# Altium project OpenRex_V1I1.PrjPcb (part 4 of 4)

## Sheet [14] - MCU.SchDoc
size A2; DocumentNumber: 14; SheetNumber: 14; SheetTotal: 31
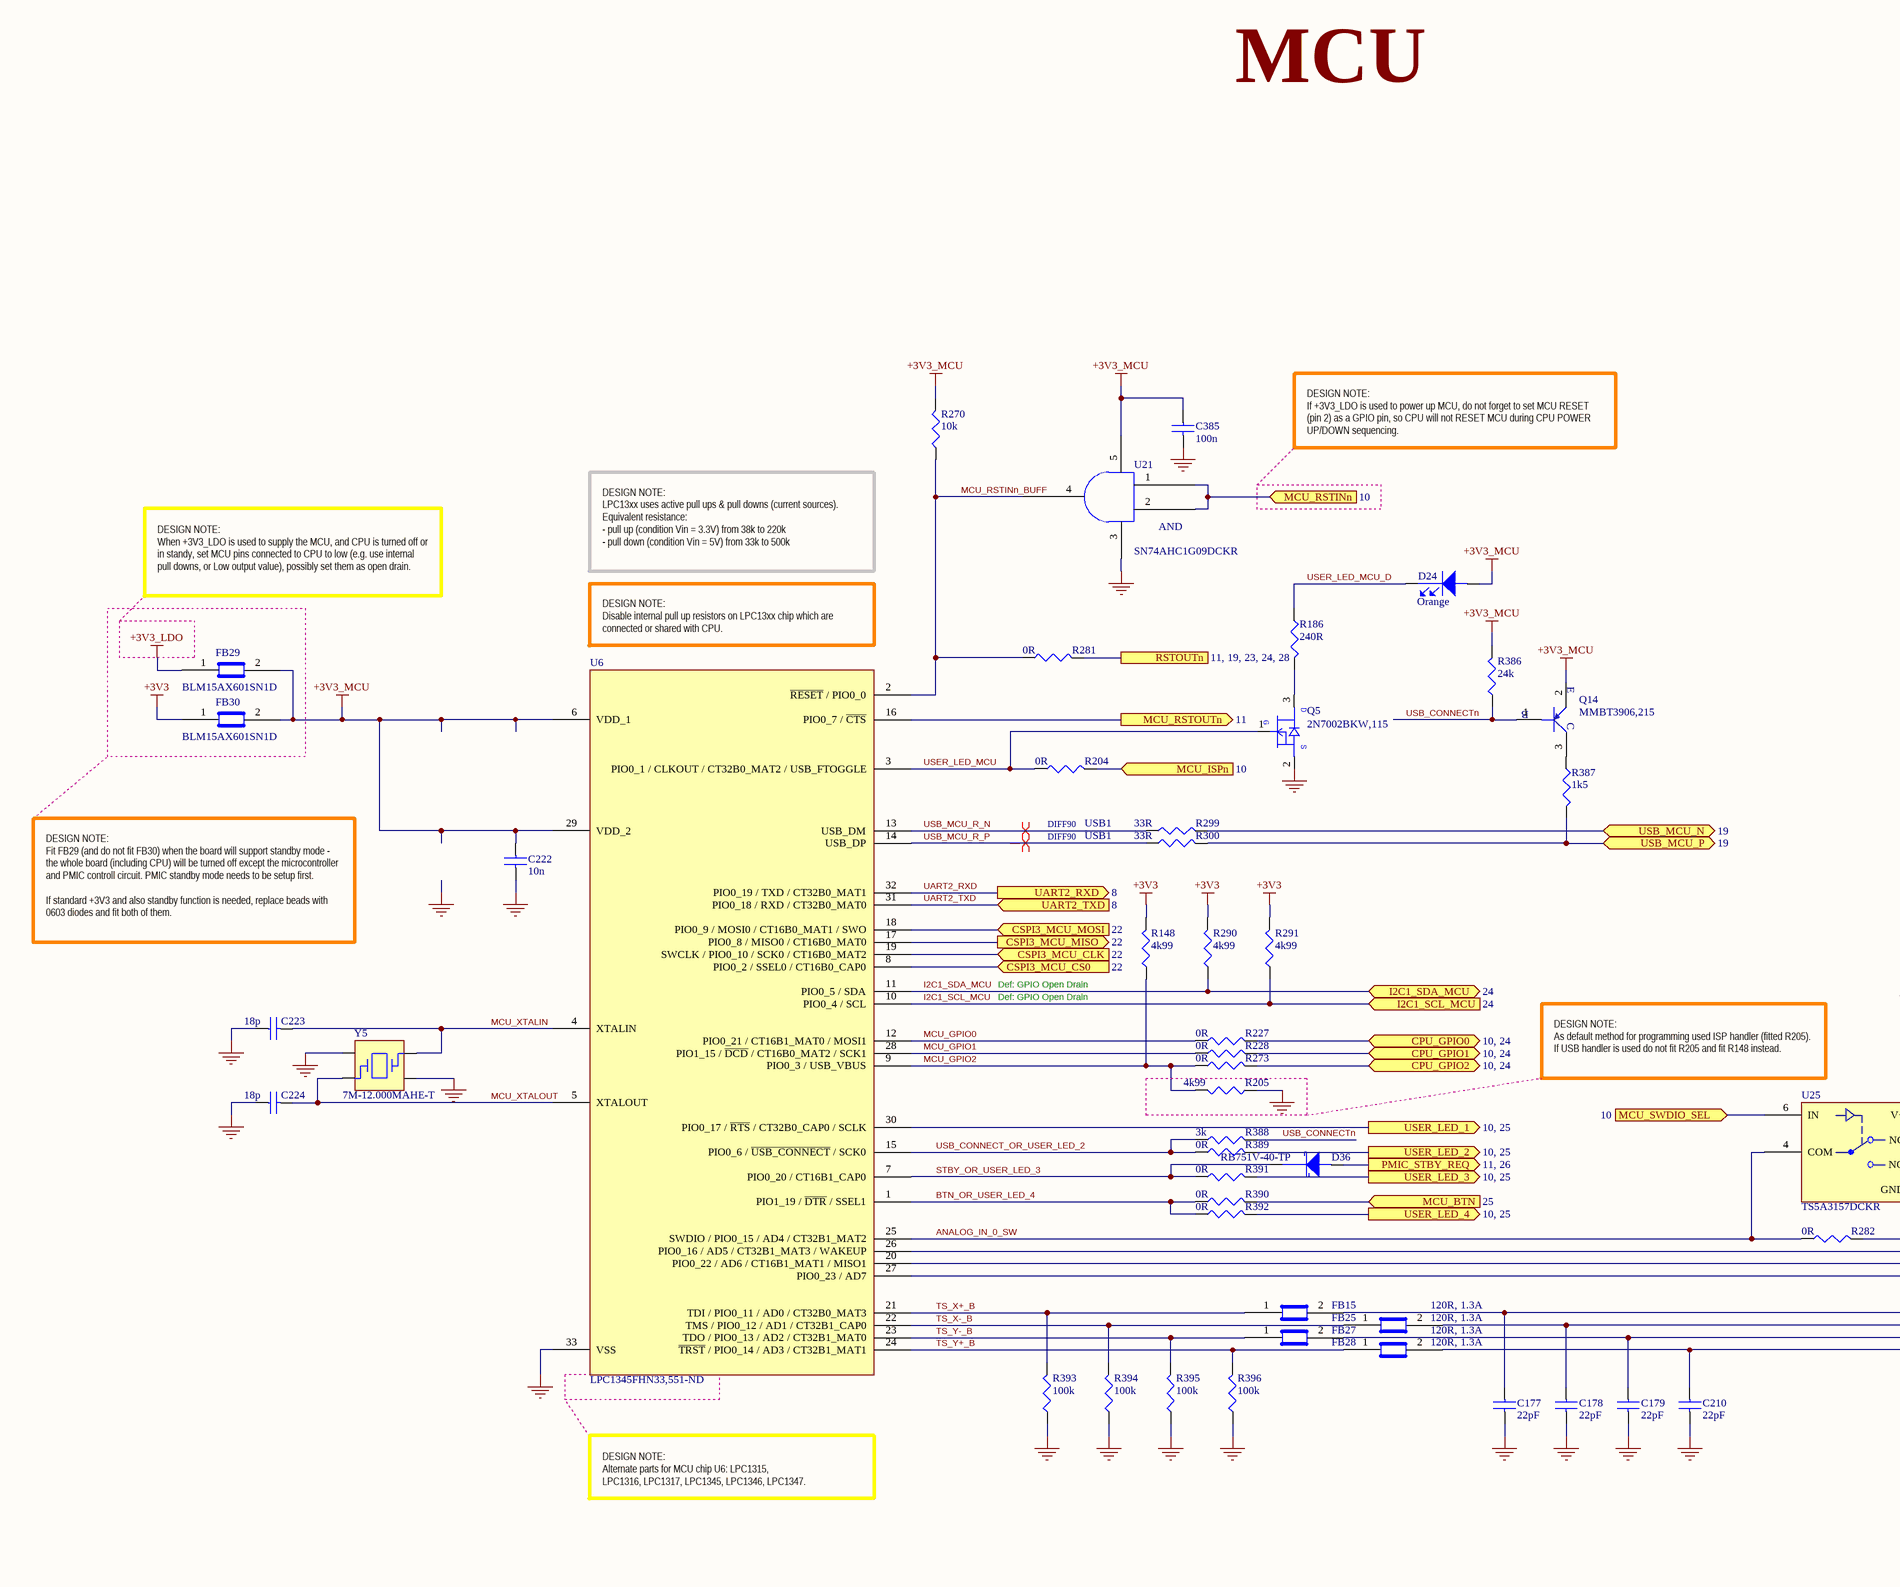
[diagram p16: [14] - MCU.SchDoc, left]
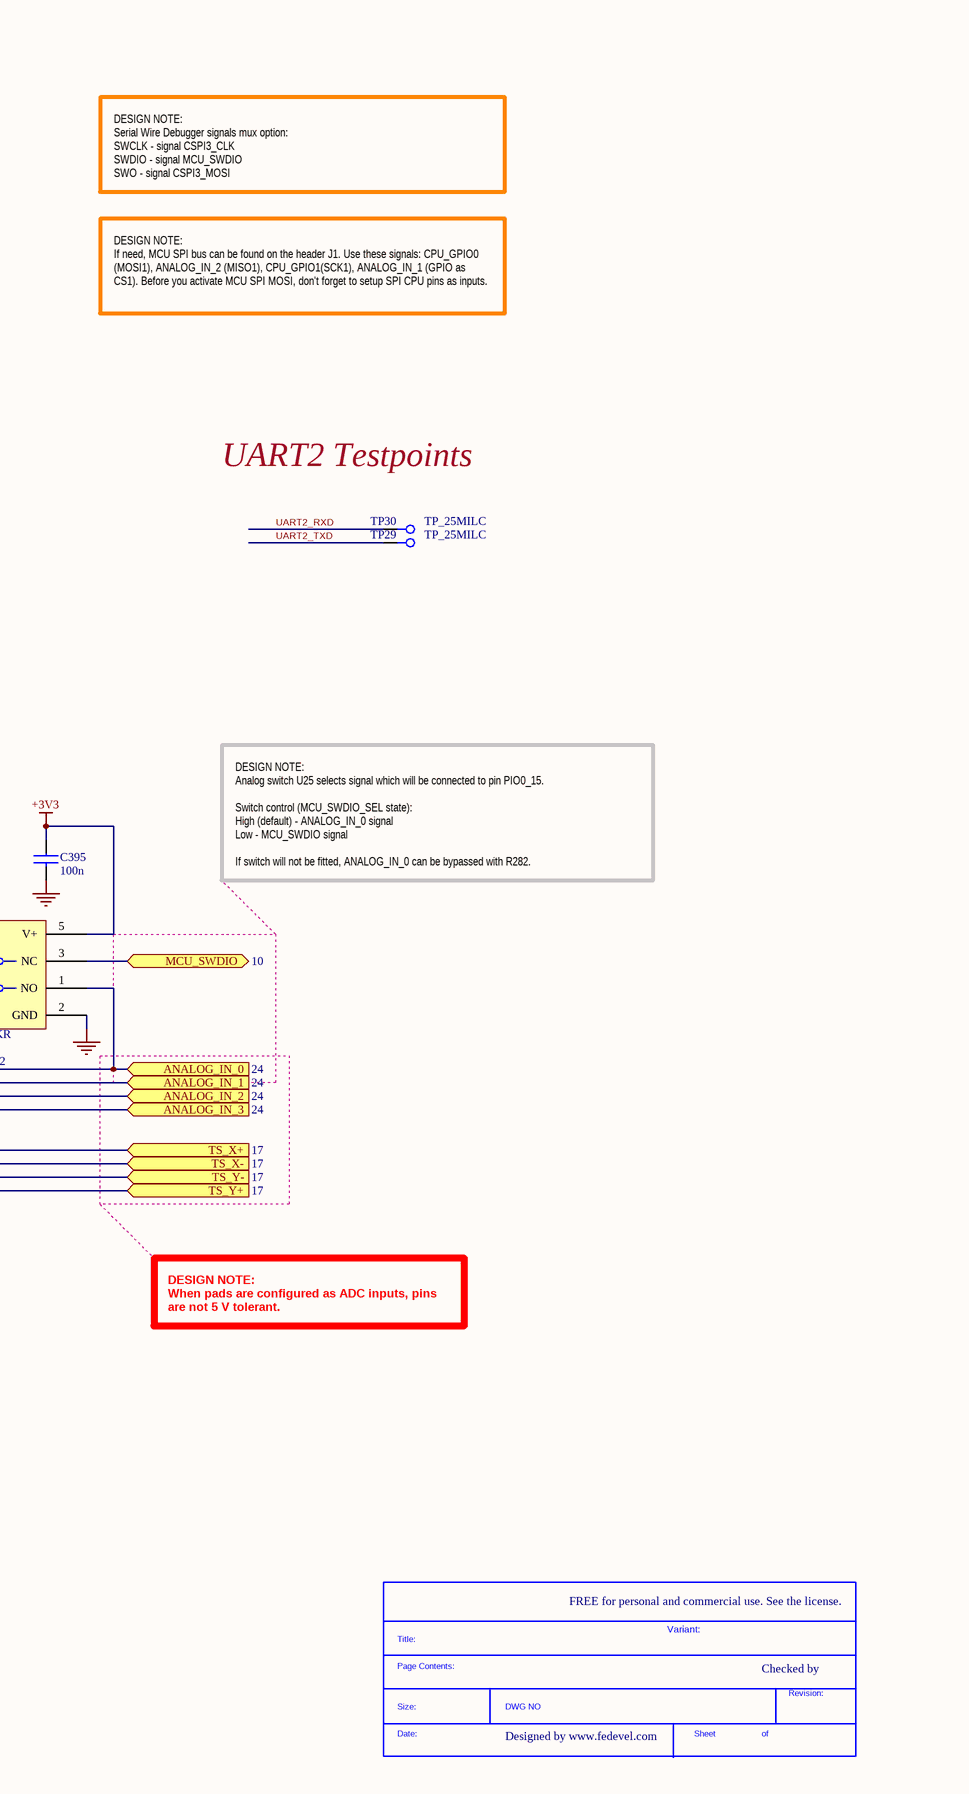
[diagram p17: [14] - MCU.SchDoc, right]

### Parts
(Parts that share a designator on the sheet are numbered #1, #2 ... from top to bottom, then left to right.)
*#11  SDTitleBlock  (value not drawn)  (graphical)
C177  22pF  [C0402]
C178  22pF  [C0402]
C179  22pF  [C0402]
C210  22pF  [C0402]
C222  10n  [C0402]
C223  18p  [C0402]
C224  18p  [C0402]
C385  100n  [C0402]
C395  100n  [C0402]
D24  Orange  [LED_0603]
D36  RB751V-40-TP  [SOD323]
FB15  120R, 1.3A  [C0402]
FB25  120R, 1.3A  [C0402]
FB27  120R, 1.3A  [C0402]
FB28  120R, 1.3A  [C0402]
FB29  BLM15AX601SN1D  [C0402]
FB30  BLM15AX601SN1D  [C0402]
Q5  2N7002BKW,115  [SC70_SOT323]
Q14  MMBT3906,215  [SOT-23-3-123]
R148  4k99  [R0402]
R186  240R  [R0402]
R204  0R  [R0402]
R205  4k99  [R0402]
R227  0R  [R0402]
R228  0R  [R0402]
R270  10k  [R0402]
R273  0R  [R0402]
R281  0R  [R0402]
R282  0R  [R0402]
R290  4k99  [R0402]
R291  4k99  [R0402]
R299  33R  [R0402]
R300  33R  [R0402]
R386  24k  [R0402]
R387  1k5  [R0402]
R388  3k  [R0402]
R389  0R  [R0402]
R390  0R  [R0402]
R391  0R  [R0402]
R392  0R  [R0402]
R393  100k  [R0402]
R394  100k  [R0402]
R395  100k  [R0402]
R396  100k  [R0402]
TP29  TP_25MILC  [TP_25C]  (no BOM)
TP30  TP_25MILC  [TP_25C]  (no BOM)
U6  LPC1345FHN33,551-ND  [HVQFN33_7x7mm]
U21  SN74AHC1G09DCKR  [SC70_5]
U25  TS5A3157DCKR  [SC70_6]
Y5  7M-12.000MAHE-T  [7M]

### Ports
ANALOG_IN_0 (in, see 24), ANALOG_IN_1 (in, see 24), ANALOG_IN_2 (in, see 24), ANALOG_IN_3 (in, see 24), CPU_GPIO0 (bidir, see 10, 24), CPU_GPIO1 (bidir, see 10, 24), CPU_GPIO2 (bidir, see 10, 24), CSPI3_MCU_CLK (in, see 22), CSPI3_MCU_CS0 (in, see 22), CSPI3_MCU_MISO (out, see 22), CSPI3_MCU_MOSI (in, see 22), I2C1_SCL_MCU (in, see 24), I2C1_SDA_MCU (bidir, see 24), MCU_BTN (in, see 25), MCU_ISPn (in, see 10), MCU_RSTINn (in, see 10), MCU_RSTOUTn (out, see 11), MCU_SWDIO (bidir, see 10), MCU_SWDIO_SEL (in, see 10), PMIC_STBY_REQ (out, see 11, 26), RSTOUTn (see 11, 19, 23, 24, 28), TS_X+ (in, see 17), TS_X- (in, see 17), TS_Y+ (in, see 17), TS_Y- (in, see 17), UART2_RXD (out, see 8), UART2_TXD (in, see 8), USB_MCU_N (bidir, see 19), USB_MCU_P (bidir, see 19), USER_LED_1 (out, see 10, 25), USER_LED_2 (out, see 10, 25), USER_LED_3 (out, see 10, 25), USER_LED_4 (out, see 10, 25)

### Nets
+3V3: C395.1 FB30.1 R148.2 R290.2 R291.2 U25.5(V+)
+3V3_LDO: FB29.1
+3V3_MCU: C222.1 C385.1 D24.2(ANODE) FB29.2 FB30.2 Q14.2(E) R270.2 R386.2 U6.6(VDD_1) U6.29(VDD_2) U21.5(VCC)
GND: C177.2 C178.2 C179.2 C210.2 C222.2 C223.1 C224.1 C385.2 C395.2 Q5.2(SOURCE) R205.1 R393.1 R394.1 R395.1 R396.1 U6.33(VSS) U21.3(GND) U25.2(GND) Y5.2 Y5.4
ANALOG_IN_0: R282.2 U25.1(NO) ; port ANALOG_IN_0
ANALOG_IN_0_SW: R282.1 U6.25(SWDIO_/_PIO0_15_/_AD4_/_CT32B1_MAT2) U25.4(COM)
ANALOG_IN_1: U6.26(PIO0_16_/_AD5_/_CT32B1_MAT3_/_WAKEUP) ; port ANALOG_IN_1
ANALOG_IN_2: U6.20(PIO0_22_/_AD6_/_CT16B1_MAT1_/_MISO1) ; port ANALOG_IN_2
ANALOG_IN_3: U6.27(PIO0_23_/_AD7) ; port ANALOG_IN_3
BTN_OR_USER_LED_4: R390.1 R392.1 U6.1(PIO1_19_/_~{DTR}_/_SSEL1)
CPU_GPIO0: R227.2 ; port CPU_GPIO0
CPU_GPIO1: R228.2 ; port CPU_GPIO1
CPU_GPIO2: R273.2 ; port CPU_GPIO2
CSPI3_MCU_CLK: U6.19(SWCLK_/_PIO0_10_/_SCK0_/_CT16B0_MAT2) ; port CSPI3_MCU_CLK
CSPI3_MCU_CS0: U6.8(PIO0_2_/_SSEL0_/_CT16B0_CAP0) ; port CSPI3_MCU_CS0
CSPI3_MCU_MISO: U6.17(PIO0_8_/_MISO0_/_CT16B0_MAT0) ; port CSPI3_MCU_MISO
CSPI3_MCU_MOSI: U6.18(PIO0_9_/_MOSI0_/_CT16B0_MAT1_/_SWO) ; port CSPI3_MCU_MOSI
I2C1_SCL_MCU: R291.1 U6.10(PIO0_4_/_SCL) ; port I2C1_SCL_MCU
I2C1_SDA_MCU: R290.1 U6.11(PIO0_5_/_SDA) ; port I2C1_SDA_MCU
MCU_BTN: R390.2 ; port MCU_BTN
MCU_GPIO0: R227.1 U6.12(PIO0_21_/_CT16B1_MAT0_/_MOSI1)
MCU_GPIO1: R228.1 U6.28(PIO1_15_/_~{DCD}_/_CT16B0_MAT2_/_SCK1)
MCU_GPIO2: R148.1 R205.2 R273.1 U6.9(PIO0_3_/_USB_VBUS)
MCU_ISPn: R204.2 ; port MCU_ISPn
MCU_RSTINn: U21.1(A) U21.2(B) ; port MCU_RSTINn
MCU_RSTINn_BUFF: R270.1 R281.1 U6.2(~{RESET}_/_PIO0_0) U21.4(Y)
MCU_RSTOUTn: U6.16(PIO0_7_/_~{CTS}) ; port MCU_RSTOUTn
MCU_SWDIO: U25.3(NC) ; port MCU_SWDIO
MCU_SWDIO_SEL: U25.6(IN) ; port MCU_SWDIO_SEL
MCU_XTALIN: C223.2 U6.4(XTALIN) Y5.1
MCU_XTALOUT: C224.2 U6.5(XTALOUT) Y5.3
PMIC_STBY_REQ: D36.2(ANODE) ; port PMIC_STBY_REQ
RSTOUTn: R281.2 ; port RSTOUTn
STBY_OR_USER_LED_3: D36.1(cathode) R391.1 U6.7(PIO0_20_/_CT16B1_CAP0)
TS_X+: C177.1 FB15.2 ; port TS_X+
TS_X+_B: FB15.1 R393.2 U6.21(TDI_/_PIO0_11_/_AD0_/_CT32B0_MAT3)
TS_X-: C178.1 FB25.2 ; port TS_X-
TS_X-_B: FB25.1 R394.2 U6.22(TMS_/_PIO0_12_/_AD1_/_CT32B1_CAP0)
TS_Y+: C210.1 FB28.2 ; port TS_Y+
TS_Y+_B: FB28.1 R396.2 U6.24(~{TRST}_/_PIO0_14_/_AD3_/_CT32B1_MAT1)
TS_Y-: C179.1 FB27.2 ; port TS_Y-
TS_Y-_B: FB27.1 R395.2 U6.23(TDO_/_PIO0_13_/_AD2_/_CT32B1_MAT0)
UART2_RXD: TP30.1 U6.32(PIO0_19_/_TXD_/_CT32B0_MAT1) ; port UART2_RXD
UART2_TXD: TP29.1 U6.31(PIO0_18_/_RXD_/_CT32B0_MAT0) ; port UART2_TXD
USB_CONNECT_OR_USER_LED_2: R388.1 R389.1 U6.15(PIO0_6_/_~{USB_CONNECT}_/_SCK0)
USB_CONNECTn: Q14.1(B) R386.1 R388.2
USB_MCU_N: R299.2 ; port USB_MCU_N
USB_MCU_P: R300.2 R387.2 ; port USB_MCU_P
USB_MCU_R_N: R299.1 U6.13(USB_DM)
USB_MCU_R_P: R300.1 U6.14(USB_DP)
USER_LED_1: U6.30(PIO0_17_/_~{RTS}_/_CT32B0_CAP0_/_SCLK) ; port USER_LED_1
USER_LED_2: R389.2 ; port USER_LED_2
USER_LED_3: R391.2 ; port USER_LED_3
USER_LED_4: R392.2 ; port USER_LED_4
USER_LED_MCU: Q5.1(GATE) R204.1 U6.3(PIO0_1_/_CLKOUT_/_CT32B0_MAT2_/_USB_FTOGGLE)
USER_LED_MCU_D: D24.1(cathode) R186.1
NetQ5_3: Q5.3(DRAIN) R186.2
NetQ14_3: Q14.3(C) R387.1

### Layout directives
differential pair; net class DIFF90; net class USB1: USB_MCU_R_N, USB_MCU_R_P

### Notes on the sheet
- MCU
- DESIGN NOTE:
  If +3V3_LDO is used to power up MCU, do not forget to set MCU RESET (pin 2) as a GPIO pin, so CPU will not RESET MCU during CPU POWER UP/DOWN sequencing.
- DESIGN NOTE:
  Serial Wire Debugger signals mux option:
  SWCLK - signal CSPI3_CLK
  SWDIO - signal MCU_SWDIO
  SWO - signal CSPI3_MOSI
- DESIGN NOTE:
  LPC13xx uses active pull ups & pull downs (current sources).
  Equivalent resistance:
  - pull up (condition Vin = 3.3V) from 38k to 220k
  - pull down (condition Vin = 5V) from 33k to 500k
- DESIGN NOTE:
  If need, MCU SPI bus can be found on the header J1. Use these signals: CPU_GPIO0 (MOSI1), ANALOG_IN_2 (MISO1), CPU_GPIO1(SCK1), ANALOG_IN_1 (GPIO as CS1). Before you activate MCU SPI MOSI, don't forget to setup SPI CPU pins as inputs.
- DESIGN NOTE:
  When +3V3_LDO is used to supply the MCU, and CPU is turned off or in standy, set MCU pins connected to CPU to low (e.g. use internal pull downs, or Low output value), possibly set them as open drain.
- DESIGN NOTE:
  Disable internal pull up resistors on LPC13xx chip which are connected or shared with CPU.
- UART2 Testpoints
- DESIGN NOTE:
  Fit FB29 (and do not fit FB30) when the board will support standby mode - the whole board (including CPU) will be turned off except the microcontroller and PMIC controll circuit. PMIC standby mode needs to be setup first.
  If standard +3V3 and also standby function is needed, replace beads with 0603 diodes and fit both of them.
- Def: GPIO Open Drain
- DESIGN NOTE:
  Analog switch U25 selects signal which will be connected to pin PIO0_15.
  Switch control (MCU_SWDIO_SEL state):
  High (default) - ANALOG_IN_0 signal
  Low - MCU_SWDIO signal
  If switch will not be fitted, ANALOG_IN_0 can be bypassed with R282.
- (near U25) DESIGN NOTE:
  As default method for programming used ISP handler (fitted R205). If USB handler is used do not fit R205 and fit R148 instead.
- DESIGN NOTE:
  Alternate parts for MCU chip U6: LPC1315,
  LPC1316, LPC1317, LPC1345, LPC1346, LPC1347.
- DESIGN NOTE:
  When pads are configured as ADC inputs, pins are not 5 V tolerant.
- FREE for personal and commercial use. See the license.
- Variant:
- Checked by
- Designed by www.fedevel.com
- (in symbol 2N7002BKW,115) D; G; S
- (in symbol SDTitleBlock) Title:; Page Contents:; Revision:; Size:; DWG NO; Date:; Sheet; of
- (in symbol SN74AHC1G09DCKR) AND

### Library data of the parts
C177-C179 C210 = C1005C0G1H220J: CAP CER 22PF 50V C0G 5% 0402; Manufacturer: TDK Corporation; .Checked PCB: used; Temperature Coefficient: C0G, NP0; Capacitance: 22pF; Category: Capacitors; Supplier Part Number: 445-1239-1-ND; Manufacturer Part Number: C1005C0G1H220J; Operating Temperature: -55°C ~ 125°C; Package / Case: 0402 (1005 Metric); Price 1k [$]: 0.00442; Value: 22pF; .Checked SCH: used; Voltage - Rated: 50V; Supplier: Digikey; Supplier 1: Digi-Key; Supplier Part Number 1: 445-1239-1-ND; RoHS: RoHS Compliant; Stock 1: 176261; Pricing 1: 1=0.08, 10=0.05, 100=0.018, 250=0.013, 500=0.0096, 1000=0.0065 (USD); Tolerance: ±5%; Mounting Type: Surface Mount, MLCC; Applications: General Purpose; Ratings: -; Size / Dimension: 0.039" L x 0.020" W (1.00mm x 0.50mm); Height - Seated (Max): -; Thickness (Max): 0.022" (0.55mm); Lead Spacing: -; Features: -; Packaging: Cut Tape (CT); Lead Style: -; ComponentLink1URL: http://www.tdk.co.jp/tefe02/e412_c.pdf; ComponentLink1Description: http://www.tdk.co.jp/tefe02/e412_c.pdf
C222 = C1005X7R1H103K: CAP CER 10000PF 50V 10% X7R 0402; Manufacturer: TDK Corporation; Value: 10nF; .Checked PCB: used; Capacitance: 10000pF; Category: Capacitors; Supplier Part Number: 445-6850-1-ND; Manufacturer Part Number: C1005X7R1H103K; Operating Temperature: -55°C ~ 125°C; Package / Case: 0402 (1005 Metric); Price 1k [$]: 0.01625; .Checked SCH: used; Voltage - Rated: 50V; Supplier: Digikey; Supplier 1: Digi-Key; Supplier Part Number 1: 445-6850-1-ND; RoHS: RoHS Compliant; Stock 1: 3901; Pricing 1: 1=0.2, 10=0.125, 100=0.045, 250=0.03252, 500=0.024, 1000=0.01625 (USD); Tolerance: ±10%; Temperature Coefficient: X7R; Mounting Type: Surface Mount, MLCC; Applications: General Purpose; Ratings: -; Size / Dimension: 0.039" L x 0.020" W (1.00mm x 0.50mm); Height - Seated (Max): -; Thickness (Max): 0.022" (0.55mm); Lead Spacing: -; Features: -; Packaging: Cut Tape (CT); Lead Style: -; ComponentLink1URL: http://www.tdk.co.jp/tefe02/e412_c.pdf; ComponentLink1Description: http://www.tdk.co.jp/tefe02/e412_c.pdf
C223 C224 = C1005C0G1H180J: CAP CER 18PF 50V C0G 5% 0402; Manufacturer: TDK Corporation; .Checked PCB: used; Temperature Coefficient: C0G, NP0; Capacitance: 18pF; Category: Capacitors; Supplier Part Number: 445-1238-1-ND; Manufacturer Part Number: C1005C0G1H180J; Operating Temperature: -55°C ~ 125°C; Package / Case: 0402 (1005 Metric); Price 1k [$]: 0.00468; Value: 18pF; .Checked SCH: used; Voltage - Rated: 50V; Supplier: Digikey; Supplier 1: Digi-Key; Supplier Part Number 1: 445-1238-1-ND; RoHS: RoHS Compliant; Stock 1: 24321; Pricing 1: 1=0.08, 10=0.05, 100=0.018, 250=0.013, 500=0.0096, 1000=0.0065 (USD); Tolerance: ±5%; Mounting Type: Surface Mount, MLCC; Applications: General Purpose; Ratings: -; Size / Dimension: 0.039" L x 0.020" W (1.00mm x 0.50mm); Height - Seated (Max): -; Thickness (Max): 0.022" (0.55mm); Lead Spacing: -; Features: -; Packaging: Cut Tape (CT); Lead Style: -; ComponentLink1URL: http://www.tdk.co.jp/tefe02/e412_c.pdf; ComponentLink1Description: http://www.tdk.co.jp/tefe02/e412_c.pdf
C385 C395 = C1005X5R1H104K: CAP CER .10UF 50V X5R 10% 0402; Manufacturer: TDK Corporation; Capacitance: 0.1µF; Value: 100nF; .Checked PCB: used; Category: Capacitors; Manufacturer Part Number: C1005X5R1H104K; Operating Temperature: -55°C ~ 85°C; Package / Case: 0402 (1005 Metric); Price 1k [$]: 0.02340; .Checked SCH: used; Voltage - Rated: 50V; Supplier Part Number: 445-5942-1-ND; Supplier: Digikey; Supplier 1: Digi-Key; Supplier Part Number 1: 445-5942-1-ND; RoHS: RoHS Compliant; Stock 1: 106926; Pricing 1: 1=0.27, 10=0.18, 100=0.072, 250=0.05176, 500=0.0369, 1000=0.027 (USD); Tolerance: ±10%; Temperature Coefficient: X5R; Mounting Type: Surface Mount, MLCC; Applications: General Purpose; Ratings: -; Size / Dimension: 0.039" L x 0.020" W (1.00mm x 0.50mm); Height - Seated (Max): -; Thickness (Max): 0.022" (0.55mm); Lead Spacing: -; Features: -; Packaging: Cut Tape (CT); Lead Style: -; ComponentLink1URL: http://www.tdk.co.jp/tefe02/e412_c.pdf; ComponentLink1Description: http://www.tdk.co.jp/tefe02/e412_c.pdf
D24 = LO L29K-H2K1-24-Z: LED SMARTLED ORANGE 606NM 0603; Manufacturer: OSRAM Opto Semiconductors Inc; Millicandela Rating: 6.3mcd; Voltage - Forward (Vf) Typ: 1.8V; Current - Test: 2mA; Wavelength - Peak: 610nm; Viewing Angle: 160°; Lens Type: Diffused; Lens Style/Size: Rectangle with Flat Top, 1.3mm x 0.8mm; Luminous Flux @ Current - Test: 25 mlm; .Checked PCB: used; Supplier 1: Digi-Key; Supplier Part Number 1: 475-2740-1-ND; Manufacturer Part Number: LO L29K-H2K1-24-Z; RoHS: RoHS Compliant; Category: Optoelectronics; Stock 1: 15900; Pricing 1: 1=0.17, 10=0.141, 100=0.1127, 250=0.0986, 500=0.09016 (USD); Color: Orange; Wavelength - Dominant: 606nm; Package / Case: 0603 (1608 Metric); Size / Dimension: 1.70mm L x 0.80mm W; Height: 0.65mm; Mounting Type: Surface Mount; Packaging: Cut Tape (CT); ComponentLink1URL: http://catalog.osram-os.com/catalogue/catalogue.do;jsessionid=302CF83AF637AE24E40AEB0ADA267EDD?act=downloadFile&favOid=020000010003f9de000100b6; ComponentLink1Description: http://catalog.osram-os.com/catalogue/catalogue.do;jsessionid=302CF83AF637AE24E40AEB0ADA267EDD?act=downloadFile&favOid=020000010003f9de000100b6; .Checked SCH: used
D36 = RB751V-40-TP: DIODE SCHTKY 30MA 30V SOD-323; Manufacturer: Micro Commercial Co; Diode Type: Schottky; Voltage - Forward (Vf) (Max) @ If: 370mV @ 1mA; Speed: Small Signal =< 200mA (Io), Any Speed; Current - Reverse Leakage @ Vr: 500nA @ 30V; Capacitance @ Vr, F: 2pF @ 1V, 1MHz; .Checked PCB: used; Supplier 1: Digi-Key; Supplier Part Number 1: RB751V-40-TPMSCT-ND; Manufacturer Part Number: RB751V-40-TP; RoHS: RoHS Compliant; Category: Discrete Semiconductor Products; Stock 1: 18964; Pricing 1: 1=0.48, 10=0.342, 100=0.2014, 250=0.14252, 500=0.1216, 1000=0.095 (USD); Voltage - DC Reverse (Vr) (Max): 30V; Current - Average Rectified (Io): 30mA; Reverse Recovery Time (trr): -; Mounting Type: Surface Mount; Package / Case: SC-76, SOD-323; Supplier Device Package: SOD-323; Packaging: Cut Tape (CT); ComponentLink1URL: http://61.222.192.61/mccsemi/up_pdf/RB751V-40(SOD-323).PDF; ComponentLink1Description: http://61.222.192.61/mccsemi/up_pdf/RB751V-40(SOD-323).PDF; .Checked SCH: used
FB15 FB25 FB27 FB28 = BLM15PD121SN1D: FERRITE CHIP 120 OHM 1300MA 0402; Manufacturer: Murata Electronics North America; Impedance @ Frequency: 120 Ohm @ 100MHz; DC Resistance (DCR): 90 mOhm Max; Filter Type: Differential Mode - Single; .Checked PCB: MM; Supplier 1: Digi-Key; Manufacturer Part Number: BLM15PD121SN1D; RoHS: RoHS Compliant; Category: Filters; Stock 1: 478960; Pricing 1: 1=0.12, 10=0.096, 50=0.0636, 100=0.0549, 250=0.04332, 500=0.03658, 1000=0.0308, 5000=0.02743 (USD); Packaging: Cut Tape (CT); Current Rating: 1.3A; Package / Case: 0402 (1005 Metric); Mounting Type: Surface Mount; Height (Max): 0.022" (0.55mm); Size / Dimension: 0.039" L x 0.020" W (1.00mm x 0.50mm); ComponentLink1URL: http://media.digikey.com/pdf/Data%20Sheets/Murata%20PDFs/BLM15P_Series.pdf; ComponentLink1Description: http://media.digikey.com/pdf/Data%20Sheets/Murata%20PDFs/BLM15P_Series.pdf; Supplier Part Number 1: 490-5203-1-ND; .Checked SCH: MM; .Creator: MM
FB29 FB30 = BLM15AX601SN1D: FERRITE CHIP 600 OHM 0402 420mA; Manufacturer: Murata Electronics North America; .Checked PCB: used; Impedance @ Frequency: 600 Ohm @ 100MHz; DC Resistance (DCR): 340 mOhm Max; Filter Type: Differential Mode - Single; Number of Lines: 1; .Checked SCH: used; Category: Filters; Manufacturer Part Number: BLM15AX601SN1D; Package / Case: 0402 (1005 Metric); Current Rating: 420mA; Supplier 1: Digi-Key; Supplier Part Number 1: 490-5441-1-ND; RoHS: RoHS Compliant; Stock 1: 34008; Pricing 1: 1=0.26, 10=0.197, 50=0.1148, 100=0.0918, 250=0.0656, 500=0.0446, 1000=0.03608, 5000=0.02821 (USD); Mounting Type: Surface Mount; Packaging: Cut Tape (CT); Height (Max): 0.022" (0.55mm); Size / Dimension: 0.039" L x 0.020" W (1.00mm x 0.50mm); ComponentLink1URL: http://search.murata.co.jp/Ceramy/image/img/PDF/ENG/L0110S0100BLM15AX_SN.pdf; ComponentLink1Description: http://search.murata.co.jp/Ceramy/image/img/PDF/ENG/L0110S0100BLM15AX_SN.pdf; Supplier Part Number: 490-5441-1-ND; Price 1k [$]: 0.03280; Value: BLM15AX601SN1D; Supplier: Digikey
Q5 = 2N7002BKW,115: MOSFET N-CH 60V 310MA SOT323; Manufacturer: NXP Semiconductors; FET Type: MOSFET N-Channel, Metal Oxide; FET Feature: Logic Level Gate; Rds On (Max) @ Id, Vgs: 1.6 Ohm @ 500mA, 10V; Vgs(th) (Max) @ Id: 2.1V @ 250µA; Gate Charge (Qg) @ Vgs: 0.6nC @ 4.5V; Input Capacitance (Ciss) @ Vds: 50pF @ 10V; Power - Max: 275mW; .Checked PCB: used; Supplier 1: Digi-Key; Supplier Part Number 1: 568-5980-1-ND; Manufacturer Part Number: 2N7002BKW,115; RoHS: RoHS Compliant; Category: Discrete Semiconductor Products; Stock 1: 15666; Pricing 1: 1=0.39, 10=0.354, 25=0.2548, 100=0.1983, 250=0.12456, 500=0.10616, 1000=0.07233 (USD); Drain to Source Voltage (Vdss): 60V; Current - Continuous Drain (Id) @ 25° C: 310mA; Mounting Type: Surface Mount; Package / Case: SC-70, SOT-323; Supplier Device Package: SC-70; Packaging: Cut Tape (CT); ComponentLink1URL: http://www.nxp.com/documents/data_sheet/2N7002BKW.pdf; ComponentLink1Description: http://www.nxp.com/documents/data_sheet/2N7002BKW.pdf; .Checked SCH: used
Q14 = MMBT3906,215: TRANS PNP 40V 0.2A SOT23; Manufacturer: NXP Semiconductors; Current - Collector (Ic) (Max): 200mA; Vce Saturation (Max) @ Ib, Ic: 400mV @ 5mA, 50mA; DC Current Gain (hFE) (Min) @ Ic, Vce: 100 @ 10mA, 1V; Power - Max: 250mW; Frequency - Transition: 250MHz; .Checked PCB: MM; Supplier 1: Digi-Key; Manufacturer Part Number: MMBT3906,215; RoHS: RoHS Compliant; Category: Discrete Semiconductor Products; Stock 1: 39823; Pricing 1: 1=0.14, 10=0.125, 25=0.1132, 100=0.0816, 250=0.04804, 500=0.03986, 1000=0.02719 (USD); Packaging: Cut Tape (CT); Transistor Type: PNP; Voltage - Collector Emitter Breakdown (Max): 40V; Current - Collector Cutoff (Max): -; Mounting Type: Surface Mount; Package / Case: TO-236-3, SC-59, SOT-23-3; Supplier Device Package: SOT-23 (TO-236AB); ComponentLink1URL: http://www.nxp.com/documents/data_sheet/MMBT3906.pdf; ComponentLink1Description: http://www.nxp.com/documents/data_sheet/MMBT3906.pdf; Supplier Part Number 1: 568-4511-1-ND; .Checked SCH: MM; .Creator: MM
R148 R205 R290 R291 = RMCF0402FT4K99: RES TF 4.99K OHM 1% 1/16W 0402; Manufacturer: Stackpole Electronics Inc; Power (Watts): 0.063W, 1/16W; .Checked PCB: used; Temperature Coefficient: ±100ppm/°C; Category: Resistors; Supplier Part Number: RMCF0402FT4K99CT-ND; Manufacturer Part Number: RMCF0402FT4K99; Package / Case: 0402 (1005 Metric); Price 1k [$]: 0.00384; Resistance (Ohms): 4.99K; Tolerance: ±1%; Value: 4k99; .Checked SCH: used; Supplier: Digikey; Supplier 1: Digi-Key; Supplier Part Number 1: RMCF0402FT4K99CT-ND; RoHS: RoHS Compliant; Stock 1: 48509; Pricing 1: 1=0.04, 10=0.025, 50=0.0138, 100=0.0105, 250=0.0078, 500=0.00576, 1000=0.00384 (USD); Composition: Thick Film; Features: -; Size / Dimension: 0.039" L x 0.020" W (1.00mm x 0.50mm); Height: 0.016" (0.40mm); Number of Terminations: 2; Packaging: Cut Tape (CT); ComponentLink1URL: http://www.seielect.com/Catalog/SEI-RMCF.pdf; ComponentLink1Description: http://www.seielect.com/Catalog/SEI-RMCF.pdf
R186 = RMCF0402FT240R: RES TF 240 OHM 1% 0.0625W 0402; Manufacturer: Stackpole Electronics Inc; Resistance (Ohms): 240; Power (Watts): 0.063W, 1/16W; .Checked PCB: used; Temperature Coefficient: ±100ppm/°C; Category: Resistors; Supplier Part Number: RMCF0402FT240RCT-ND; Manufacturer Part Number: RMCF0402FT240R; Package / Case: 0402 (1005 Metric); Price 1k [$]: 0.00384; Tolerance: ±1%; Value: 240R; .Checked SCH: used; Supplier: Digikey; Supplier 1: Digi-Key; Supplier Part Number 1: RMCF0402FT240RCT-ND; RoHS: RoHS Compliant; Stock 1: 39860; Pricing 1: 1=0.04, 10=0.025, 50=0.0138, 100=0.0105, 250=0.0078, 500=0.00576, 1000=0.00384 (USD); Composition: Thick Film; Features: -; Size / Dimension: 0.039" L x 0.020" W (1.00mm x 0.50mm); Height: 0.016" (0.40mm); Number of Terminations: 2; Packaging: Cut Tape (CT); ComponentLink1URL: http://www.seielect.com/Catalog/SEI-RMCF.pdf; ComponentLink1Description: http://www.seielect.com/Catalog/SEI-RMCF.pdf
R204 R227 R228 R273 R281 R282 R389-R392 = RC0402JR-070RL: RES 0.0 OHM 1/16W 0402 SMD; Manufacturer: Yageo; Resistance (Ohms): 0.0; Power (Watts): 0.063W, 1/16W; Tolerance: Jumper; .Checked PCB: used; Category: Resistors; Supplier Part Number: 311-0.0JRCT-ND; Manufacturer Part Number: RC0402JR-070RL; Package / Case: 0402 (1005 Metric); Price 1k [$]: 0.01389; Value: 0R; .Checked SCH: used; Supplier: Digikey; Supplier 1: Digi-Key; Supplier Part Number 1: 311-0.0JRCT-ND; RoHS: RoHS Compliant; Stock 1: 1106330; Pricing 1: 10=0.012, 50=0.009, 100=0.0069, 250=0.00512, 500=0.0038, 1000=0.00253 (USD); Composition: Thick Film; Features: -; Temperature Coefficient: -; Size / Dimension: 0.039" L x 0.020" W (1.00mm x 0.50mm); Height: 0.016" (0.40mm); Number of Terminations: 2; Packaging: Cut Tape (CT); ComponentLink1URL: http://www.yageo.com/documents/recent/PYu-RC0402_51_RoHS_L_6.pdf; ComponentLink1Description: http://www.yageo.com/documents/recent/PYu-RC0402_51_RoHS_L_6.pdf
R270 = RC0402FR-0710KL: RES 10.0K OHM 1/16W 1% 0402 SMD; Manufacturer: Yageo; Power (Watts): 0.063W, 1/16W; .Checked PCB: used; Temperature Coefficient: ±100ppm/°C; Category: Resistors; Supplier Part Number: 311-10.0KLRCT-ND; Manufacturer Part Number: RC0402FR-0710KL; Package / Case: 0402 (1005 Metric); Price 1k [$]: 0.01421; Resistance (Ohms): 10K; Tolerance: ±1%; Value: 10k; .Checked SCH: used; Supplier: Digikey; Supplier 1: Digi-Key; Supplier Part Number 1: 311-10.0KLRCT-ND; RoHS: RoHS Compliant; Stock 1: 2916495; Pricing 1: 10=0.014, 50=0.0104, 100=0.0079, 250=0.00584, 500=0.00432, 1000=0.00288 (USD); Composition: Thick Film; Features: -; Size / Dimension: 0.039" L x 0.020" W (1.00mm x 0.50mm); Height: 0.016" (0.40mm); Number of Terminations: 2; Packaging: Cut Tape (CT); ComponentLink1URL: http://www.yageo.com/documents/recent/PYu-RC0402_51_RoHS_L_6.pdf; ComponentLink1Description: http://www.yageo.com/documents/recent/PYu-RC0402_51_RoHS_L_6.pdf
R299 R300 = RMCF0402FT33R0: RES TF 33 OHM 1% 1/16W 0402; Manufacturer: Stackpole Electronics Inc; Resistance (Ohms): 33; Power (Watts): 0.063W, 1/16W; .Checked PCB: used; Temperature Coefficient: ±100ppm/°C; Category: Resistors; Supplier Part Number: RMCF0402FT33R0CT-ND; Manufacturer Part Number: RMCF0402FT33R0; Package / Case: 0402 (1005 Metric); Price 1k [$]: 0.00384; Tolerance: ±1%; Value: 33R; .Checked SCH: used; Supplier: Digikey; Supplier 1: Digi-Key; Supplier Part Number 1: RMCF0402FT33R0CT-ND; RoHS: RoHS Compliant; Stock 1: 26866; Pricing 1: 1=0.04, 10=0.025, 50=0.0138, 100=0.0105, 250=0.0078, 500=0.00576, 1000=0.00384 (USD); Composition: Thick Film; Features: -; Size / Dimension: 0.039" L x 0.020" W (1.00mm x 0.50mm); Height: 0.016" (0.40mm); Number of Terminations: 2; Packaging: Cut Tape (CT); ComponentLink1URL: http://www.seielect.com/Catalog/SEI-RMCF.pdf; ComponentLink1Description: http://www.seielect.com/Catalog/SEI-RMCF.pdf
R386 = RC0402FR-0724KL: RES SMD 24K OHM 1% 1/16W 0402; Manufacturer: Yageo; Power (Watts): 0.063W, 1/16W; Temperature Coefficient: ±100ppm/°C; .Creator: MM; Supplier 1: Digi-Key; Manufacturer Part Number: RC0402FR-0724KL; RoHS: RoHS Compliant; Category: Resistors; Stock 1: 85479; Pricing 1: 1=0.1, 10=0.013, 25=0.0096, 100=0.0054, 250=0.00412, 500=0.00328, 1000=0.00242, 2500=0.0021, 5000=0.00173 (USD); Packaging: Cut Tape (CT); Resistance (Ohms): 24k; Tolerance: ±1%; Composition: Thick Film; Features: Moisture Resistant; Operating Temperature: -55°C ~ 155°C; Package / Case: 0402 (1005 Metric); Supplier Device Package: 0402; Size / Dimension: 0.039" L x 0.020" W (1.00mm x 0.50mm); Height: 0.016" (0.40mm); Number of Terminations: 2; ComponentLink1URL: http://www.yageo.com/NewPortal/yageodocoutput?fileName=/pdf/R-Chip/PYu-RC_Group_51_RoHS_L_3.pdf; ComponentLink1Description: http://www.yageo.com/NewPortal/yageodocoutput?fileName=/pdf/R-Chip/PYu-RC_Group_51_RoHS_L_3.pdf; Supplier Part Number 1: 311-24KLRCT-ND; .Checked PCB: MM; .Checked SCH: MM
R387 = RC0402FR-071K5L: RES 1.50K OHM 1/16W 1% 0402 SMD; Manufacturer: Yageo; Resistance (Ohms): 1.5k; Power (Watts): 0.063W, 1/16W; Temperature Coefficient: ±100ppm/°C; .Creator: MM; Supplier 1: Digi-Key; Manufacturer Part Number: RC0402FR-071K5L; RoHS: RoHS Compliant; Category: Resistors; Stock 1: 499348; Pricing 1: 1=0.1, 10=0.014, 25=0.0104, 100=0.0063, 250=0.0054, 500=0.00382, 1000=0.0027, 2500=0.00234, 5000=0.00203 (USD); Packaging: Cut Tape (CT); Tolerance: ±1%; Composition: Thick Film; Features: -; Package / Case: 0402 (1005 Metric); Supplier Device Package: 0402; Size / Dimension: 0.039" L x 0.020" W (1.00mm x 0.50mm); Height: 0.016" (0.40mm); Number of Terminations: 2; ComponentLink1URL: http://www.yageo.com/documents/recent/PYu-RC0402_51_RoHS_L_6.pdf; ComponentLink1Description: http://www.yageo.com/documents/recent/PYu-RC0402_51_RoHS_L_6.pdf; Supplier Part Number 1: 311-1.50KLRCT-ND; .Checked PCB: MM; .Checked SCH: MM
R388 = RC0402FR-073KL: RES 3K OHM 1/16W 1% 0402 SMD; Manufacturer: Yageo; Power (Watts): 0.063W, 1/16W; Temperature Coefficient: ±100ppm/°C; .Creator: MM; .Checked SCH: used; Supplier 1: Digi-Key; Manufacturer Part Number: RC0402FR-073KL; RoHS: RoHS Compliant; Category: Resistors; Stock 1: 194271; Pricing 1: 1=0.1, 10=0.014, 25=0.0104, 100=0.0063, 250=0.0054, 500=0.00382, 1000=0.0027, 2500=0.00234, 5000=0.00203 (USD); Packaging: Cut Tape (CT); Resistance (Ohms): 3k; Tolerance: ±1%; Composition: Thick Film; Features: -; Package / Case: 0402 (1005 Metric); Supplier Device Package: 0402; Size / Dimension: 0.039" L x 0.020" W (1.00mm x 0.50mm); Height: 0.016" (0.40mm); Number of Terminations: 2; ComponentLink1URL: http://www.yageo.com/documents/recent/PYu-RC0402_51_RoHS_L_6.pdf; ComponentLink1Description: http://www.yageo.com/documents/recent/PYu-RC0402_51_RoHS_L_6.pdf; Supplier Part Number 1: 311-3KLRCT-ND; .Checked PCB: used
R393-R396 = RMCF0402FT100K: RES 100K OHM 1/16W 1% 0402 SMD; Manufacturer: Stackpole Electronics Inc; Power (Watts): 0.063W, 1/16W; .Checked PCB: used; Temperature Coefficient: ±100ppm/°C; Category: Resistors; Supplier Part Number: RMCF0402FT100KCT-ND; Manufacturer Part Number: RMCF0402FT100K; Package / Case: 0402 (1005 Metric); Price 1k [$]: 0.00384; Resistance (Ohms): 100K; Tolerance: ±1%; Value: 100k; .Checked SCH: used; Supplier: Digikey; Supplier 1: Digi-Key; Supplier Part Number 1: RMCF0402FT100KCT-ND; RoHS: RoHS Compliant; Stock 1: 95; Pricing 1: 1=0.04, 10=0.025, 50=0.0138, 100=0.0105, 250=0.0078, 500=0.00576, 1000=0.00384 (USD); Composition: Thick Film; Features: -; Size / Dimension: 0.039" L x 0.020" W (1.00mm x 0.50mm); Height: 0.016" (0.40mm); Number of Terminations: 2; Packaging: Cut Tape (CT); ComponentLink1URL: http://www.seielect.com/Catalog/SEI-RMCF.pdf; ComponentLink1Description: http://www.seielect.com/Catalog/SEI-RMCF.pdf
TP29 TP30 = TP_25MILC: Test Point 25mil
U6 = LPC1345FHN33,551: IC MCU ARM 32KB FLASH 32HVQFN; Manufacturer: NXP Semiconductors; Core Processor: ARM® Cortex®-M3; Core Size: 32-Bit; Speed: 72MHz; Connectivity: I²C, Microwire, SPI, SSI, SSP, UART/USART, USB; Peripherals: Brown-out Detect/Reset, POR, WDT; Number of I/O: 26; Program Memory Size: 32KB (32K x 8); EEPROM Size: 2K x 8; RAM Size: 10K x 8; Voltage - Supply (Vcc/Vdd): 2 V ~ 3.6 V; Data Converters: A/D 8x12b; Oscillator Type: Internal; .Checked PCB: MM; Supplier 1: Digi-Key; Manufacturer Part Number: LPC1345FHN33,551; RoHS: RoHS Compliant; Category: Integrated Circuits (ICs); Stock 1: 0; Pricing 1: 260=3.2745 (USD); Packaging: Tray; Program Memory Type: FLASH; Operating Temperature: -40°C ~ 85°C; Package / Case: 32-VQFN Exposed Pad; Supplier Device Package: 32-HVQFN (7x7); ComponentLink1URL: http://www.nxp.com/documents/data_sheet/LPC1315_16_17_45_46_47.pdf; ComponentLink1Description: http://www.nxp.com/documents/data_sheet/LPC1315_16_17_45_46_47.pdf; Supplier Part Number 1: LPC1345FHN33,551-ND; .Checked SCH: MM; .Creator: MM
U21 = SN74AHC1G09DCKR: IC GATE AND 1CH 2-INP SC-70-5; Manufacturer: Texas Instruments; Logic Type: AND Gate; Number of Circuits: 1; Number of Inputs: 2; Voltage - Supply: 2 V ~ 5.5 V; Current - Quiescent (Max): 1µA; Current - Output High, Low: -, 8mA; Logic Level - Low: 0.5 V ~ 1.65 V; Logic Level - High: 1.5 V ~ 3.85 V; Max Propagation Delay @ V, Max CL: 7.5ns @ 5V, 50pF; .Creator: MM; .Checked PCB: RF, used by MM; Supplier 1: Digi-Key; Manufacturer Part Number: SN74AHC1G09DCKR; RoHS: RoHS Compliant; Category: Integrated Circuits (ICs); Stock 1: 2059; Pricing 1: 1=0.49, 10=0.345, 25=0.2836, 100=0.2265, 250=0.165, 500=0.134, 750=0.11351, 1000=0.103 (USD); Packaging: Cut Tape (CT); Features: Open Drain; Operating Temperature: -55°C ~ 125°C; Mounting Type: Surface Mount; Supplier Device Package: SC-70-5; Package / Case: 6-TSSOP (5 Lead), SC-88A, SOT-353; ComponentLink1URL: http://www.ti.com/lit/ds/symlink/sn74ahc1g09.pdf; ComponentLink1Description: http://www.ti.com/lit/ds/symlink/sn74ahc1g09.pdf; Supplier Part Number 1: 296-29203-1-ND; .Checked SCH: MM
U25 = TS5A3157DCKR: IC SWITCH SPDT SC70-6; Manufacturer: Texas Instruments; Circuit: 1 x SPDT; On-State Resistance: 10 Ohm; Voltage Supply Source: Single Supply; Voltage - Supply, Single/Dual (±): 1.65 V ~ 5.5 V; Current - Supply: 2.5µA; .Checked PCB: MM; Supplier 1: Digi-Key; Manufacturer Part Number: TS5A3157DCKR; RoHS: RoHS Compliant; Category: Integrated Circuits (ICs); Stock 1: 2204; Pricing 1: 1=0.42, 10=0.325, 100=0.171, 1000=0.153 (USD); Packaging: Cut Tape (CT); Function: Switch; Operating Temperature: -40°C ~ 85°C; Mounting Type: Surface Mount; Package / Case: 6-TSSOP, SC-88, SOT-363; Supplier Device Package: SC-70-6; ComponentLink1URL: http://www.ti.com/lit/ds/symlink/ts5a3157.pdf; ComponentLink1Description: http://www.ti.com/lit/ds/symlink/ts5a3157.pdf; Supplier Part Number 1: 296-17588-1-ND; .Checked SCH: MM; .Creator: MM
Y5 = 7M-12.000MAHE-T: CRYSTAL 12MHZ 12PF SMD; Manufacturer: TXC CORPORATION; Frequency Stability: ±30ppm; ESR (Equivalent Series Resistance): 100 Ohm; Operating Mode: Fundamental; .Creator: MM; Supplier 1: Digi-Key; Manufacturer Part Number: 7M-12.000MAHE-T; RoHS: RoHS Compliant; Category: Crystals and Oscillators; Stock 1: 2813; Pricing 1: 1=0.96, 10=0.847, 50=0.791, 100=0.7, 500=0.6615, 1000=0.553 (USD); Packaging: Cut Tape (CT); Type: MHz Crystal; Frequency: 12MHz; Frequency Tolerance: ±30ppm; Load Capacitance: 12pF; Operating Temperature: -40°C ~ 85°C; Ratings: -; Mounting Type: Surface Mount; Package / Case: 4-SMD, No Lead (DFN, LCC); Size / Dimension: 0.126" L x 0.098" W (3.20mm x 2.50mm); Height: 0.031" (0.80mm); ComponentLink1URL: http://www.txccrystal.com/images/pdf/7m.pdf; ComponentLink1Description: http://www.txccrystal.com/images/pdf/7m.pdf; Supplier Part Number 1: 887-1775-1-ND; .Checked PCB: MM; .Checked SCH: MM

## Nets that join several sheets
+1V1_VDDSOC_CAP: [04] - CPU - PCIE, USB (C78.1 FB1.1 R13.1), [05] - CPU - HDMI, LVDS (C246.1 R27.1), [06] - CPU - ETHERNET, SATA (R18.1)
+1V5_DDR: [03] - CPU - DDR3, DDR3 MEM (147 pins), [11] - CPU - JTAG, CONTROL (R302.2)
+2V5: [04] - CPU - PCIE, USB (C244.1 R14.1), [05] - CPU - HDMI, LVDS (C247.1 R29.1 R36.1), [06] - CPU - ETHERNET, SATA (C209.1 R19.1)
+3V3: [04] - CPU - PCIE, USB (R116.2 R260.2), [05] - CPU - HDMI, LVDS (R21.2 R118.2), [08] - CPU - SPI, UART (R319.2), [09] - CPU - SD, AUDIO, I2C, CAN (10 pins), [10] - CPU - GPIO, PWM, LEDS, BUTTONS (6 pins), [11] - CPU - JTAG, CONTROL (13 pins), [14] - MCU (6 pins)
GND: [03] - CPU - DDR3, DDR3 MEM (164 pins), [04] - CPU - PCIE, USB (13 pins), [05] - CPU - HDMI, LVDS (10 pins), [06] - CPU - ETHERNET, SATA (C81.2 C82.2 C209.2 R99.1), [07] - CPU - CSI, DISP (R160.1), [11] - CPU - JTAG, CONTROL (28 pins), [14] - MCU (20 pins)
CPU_GPIO0: [10] - CPU - GPIO, PWM, LEDS, BUTTONS (U1.B17), [14] - MCU (R227.2)
CPU_GPIO1: [10] - CPU - GPIO, PWM, LEDS, BUTTONS (U1.B16), [14] - MCU (R228.2)
CPU_GPIO2: [10] - CPU - GPIO, PWM, LEDS, BUTTONS (U1.E23), [14] - MCU (R273.2)
MCU_ISPn: [10] - CPU - GPIO, PWM, LEDS, BUTTONS (R213.1 U1.B21), [14] - MCU (R204.2)
MCU_RSTINn: [10] - CPU - GPIO, PWM, LEDS, BUTTONS (R212.1 U1.A21), [14] - MCU (U21.1 U21.2)
MCU_RSTOUTn: [11] - CPU - JTAG, CONTROL (R93.1), [14] - MCU (U6.16)
MCU_SWDIO: [10] - CPU - GPIO, PWM, LEDS, BUTTONS (TP31.1 U1.P1), [14] - MCU (U25.3)
MCU_SWDIO_SEL: [10] - CPU - GPIO, PWM, LEDS, BUTTONS (R289.1 U1.N2), [14] - MCU (U25.6)
PCIE_RSTn_R: [04] - CPU - PCIE, USB (U1.V5), [11] - CPU - JTAG, CONTROL (R170.2)
PMIC_STBY_REQ: [11] - CPU - JTAG, CONTROL (D28.2), [14] - MCU (D36.2)
RSTOUTn: [11] - CPU - JTAG, CONTROL (R144.2 U11.4), [14] - MCU (R281.2)
UART2_RXD: [08] - CPU - SPI, UART (U1.D13), [14] - MCU (TP30.1 U6.32)
UART2_TXD: [08] - CPU - SPI, UART (U1.C13), [14] - MCU (TP29.1 U6.31)
USER_LED_1: [10] - CPU - GPIO, PWM, LEDS, BUTTONS (U1.A18), [14] - MCU (U6.30)
USER_LED_2: [10] - CPU - GPIO, PWM, LEDS, BUTTONS (U1.C17), [14] - MCU (R389.2)
USER_LED_3: [10] - CPU - GPIO, PWM, LEDS, BUTTONS (U1.F16), [14] - MCU (R391.2)
USER_LED_4: [10] - CPU - GPIO, PWM, LEDS, BUTTONS (U1.D17), [14] - MCU (R392.2)
VID_IN_CSI1_RSTn_R: [07] - CPU - CSI, DISP (U1.N22), [11] - CPU - JTAG, CONTROL (R179.2)

## Assembly variants
Production: not fitted C177 C178 C179 C210 C237 C252 C263 C264 C327 C328 C390 C391 C392 C393 C406 C407 C408 C409 C410 C411 C416 C417 C418 C432 C433 D4 D8 D28 D29 D30 D31 D32 D36 D38 D39 FB2 FB8 FB17 FB20 FB26 FB29 FB32 FB35 FB38 FB41 FB42 FB43 L12 LINK1 LINK2 Q14 R15 R21 R24 R41 R52 R53 R54 R57 R58 R60 R65 R67 R68 R70 R87 R93 R104 R110 R114 R117 R119 R121 R123 R126 R128 R135 R138 R147 R148 R158 R159 R167 R168 R171 R174 R177 R178 R182 R191 R197 R199 R203 R207 R208 R209 R210 R211 R215 R216 R217 R234 R236 R239 R245 R250 R258 R261 R266 R271 R272 R274 R281 R282 R287 R290 R291 R294 R295 R298 R304 R310 R313 R316 R322 R325 R328 R331 R334 R335 R336 R337 R338 R339 R340 R341 R342 R343 R344 R347 R350 R352 R355 R357 R359 R360 R365 R367 R368 R371 R373 R374 R376 R378 R383 R385 R386 R387 R388 R392 R393 R394 R395 R396 R400 R401 R403 R408 R411 R412 R413 U17 U30 U34